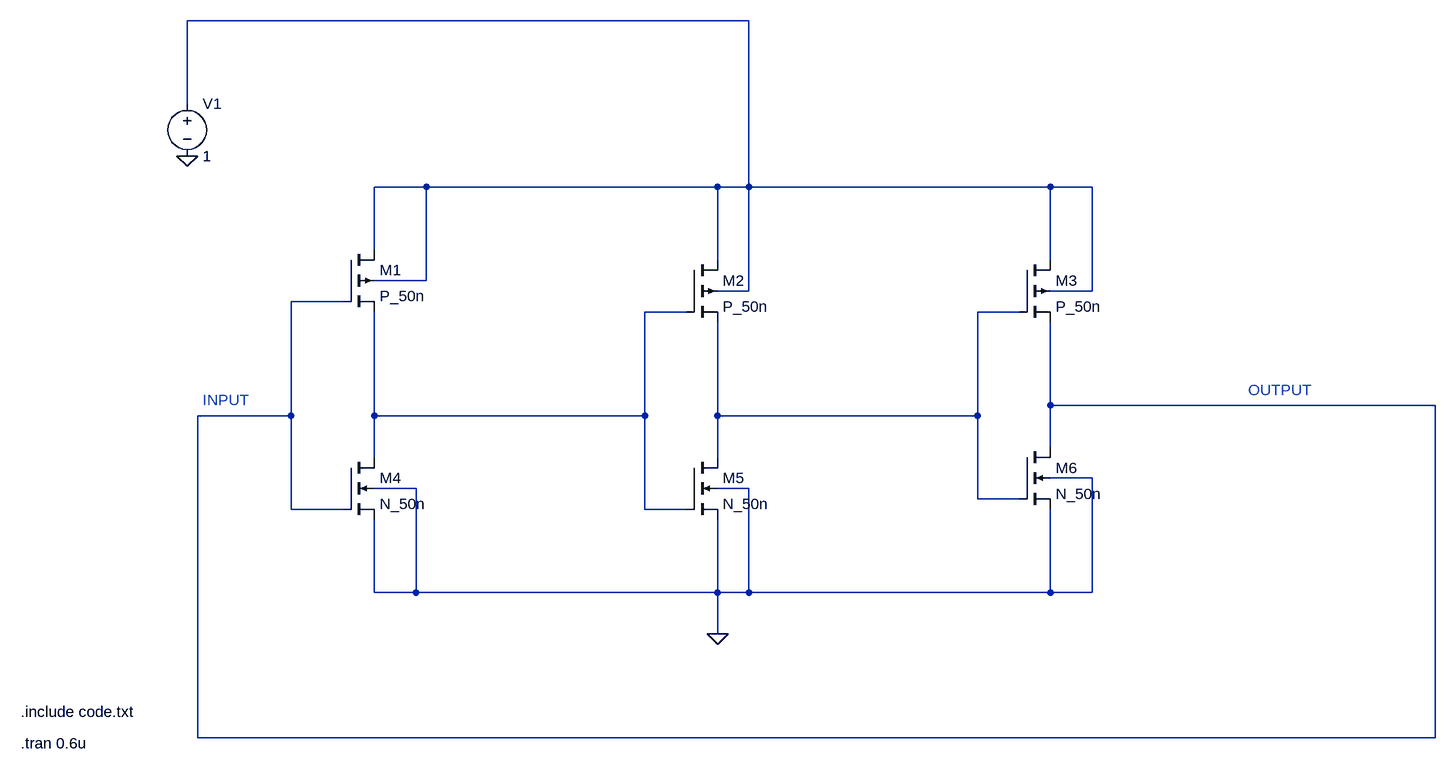
[diagram p0: schematic Circuit1_RingOscillator.asc]
Circuit1_RingOscillator.asc, the LTspice schematic file:
Version 4
SHEET 1 1252 868
WIRE 192 -704 -672 -704
WIRE -672 -576 -672 -704
WIRE -304 -448 -384 -448
WIRE 144 -448 -304 -448
WIRE 192 -448 192 -704
WIRE 192 -448 144 -448
WIRE 656 -448 192 -448
WIRE 720 -448 656 -448
WIRE -384 -352 -384 -448
WIRE 144 -336 144 -448
WIRE 656 -336 656 -448
WIRE -304 -304 -304 -448
WIRE -304 -304 -384 -304
WIRE 192 -288 192 -448
WIRE 192 -288 144 -288
WIRE 720 -288 720 -448
WIRE 720 -288 656 -288
WIRE -432 -272 -512 -272
WIRE 96 -256 32 -256
WIRE 608 -256 544 -256
WIRE 656 -112 656 -240
WIRE 1248 -112 656 -112
WIRE -512 -96 -512 -272
WIRE -512 -96 -656 -96
WIRE -384 -96 -384 -256
WIRE 32 -96 32 -256
WIRE 32 -96 -384 -96
WIRE 144 -96 144 -240
WIRE 544 -96 544 -256
WIRE 544 -96 144 -96
WIRE 656 -48 656 -112
WIRE -384 -32 -384 -96
WIRE 144 -32 144 -96
WIRE 720 0 656 0
WIRE -320 16 -384 16
WIRE 192 16 144 16
WIRE 544 32 544 -96
WIRE 608 32 544 32
WIRE -512 48 -512 -96
WIRE -432 48 -512 48
WIRE 32 48 32 -96
WIRE 96 48 32 48
WIRE -384 176 -384 64
WIRE -320 176 -320 16
WIRE -320 176 -384 176
WIRE 144 176 144 64
WIRE 144 176 -320 176
WIRE 192 176 192 16
WIRE 192 176 144 176
WIRE 656 176 656 48
WIRE 656 176 192 176
WIRE 720 176 720 0
WIRE 720 176 656 176
WIRE 144 240 144 176
WIRE -656 400 -656 -96
WIRE 1248 400 1248 -112
WIRE 1248 400 -656 400
FLAG -672 -496 0
FLAG 144 240 0
SYMBOL pmos4 -432 -352 R0
SYMATTR InstName M1
SYMATTR Value2 l=1u w=10u
SYMATTR Value P_50n
SYMBOL pmos4 96 -336 R0
SYMATTR InstName M2
SYMATTR Value2 l=1u w=10u
SYMATTR Value P_50n
SYMBOL pmos4 608 -336 R0
SYMATTR InstName M3
SYMATTR Value2 l=1u w=10u
SYMATTR Value P_50n
SYMBOL nmos4 -432 -32 R0
SYMATTR InstName M4
SYMATTR Value2 l=1u w=10u
SYMATTR Value N_50n
SYMBOL nmos4 96 -32 R0
SYMATTR InstName M5
SYMATTR Value2 l=1u w=10u
SYMATTR Value N_50n
SYMBOL nmos4 608 -48 R0
SYMATTR InstName M6
SYMATTR Value2 l=1u w=10u
SYMATTR Value N_50n
SYMBOL voltage -672 -592 R0
WINDOW 123 0 0 Left 0
WINDOW 39 24 44 Left 2
SYMATTR InstName V1
SYMATTR Value 1
TEXT -928 360 Left 2 !.include code.txt
TEXT 960 -136 Left 2 ;OUTPUT
TEXT -648 -120 Left 2 ;INPUT
TEXT -928 408 Left 2 !.tran 0.6u

The netlist it stands for:
* Circuit1_RingOscillator.asc
M1 N001 N002 N003 N001 P_50n l=1u w=10u
M2 N001 N003 N004 N001 P_50n l=1u w=10u
M3 N001 N004 N002 N001 P_50n l=1u w=10u
M4 N003 N002 0 0 N_50n l=1u w=10u
M5 N004 N003 0 0 N_50n l=1u w=10u
M6 N002 N004 0 0 N_50n l=1u w=10u
V1 N001 0 1
.model NMOS NMOS
.model PMOS PMOS
.lib standard.mos
.include code.txt
* OUTPUT
* INPUT
.tran 0.6u
.backanno
.end